# EasyEDA Pro project 9DTact_LED_ProEAD.epro

# Schematic LED-SCHEME
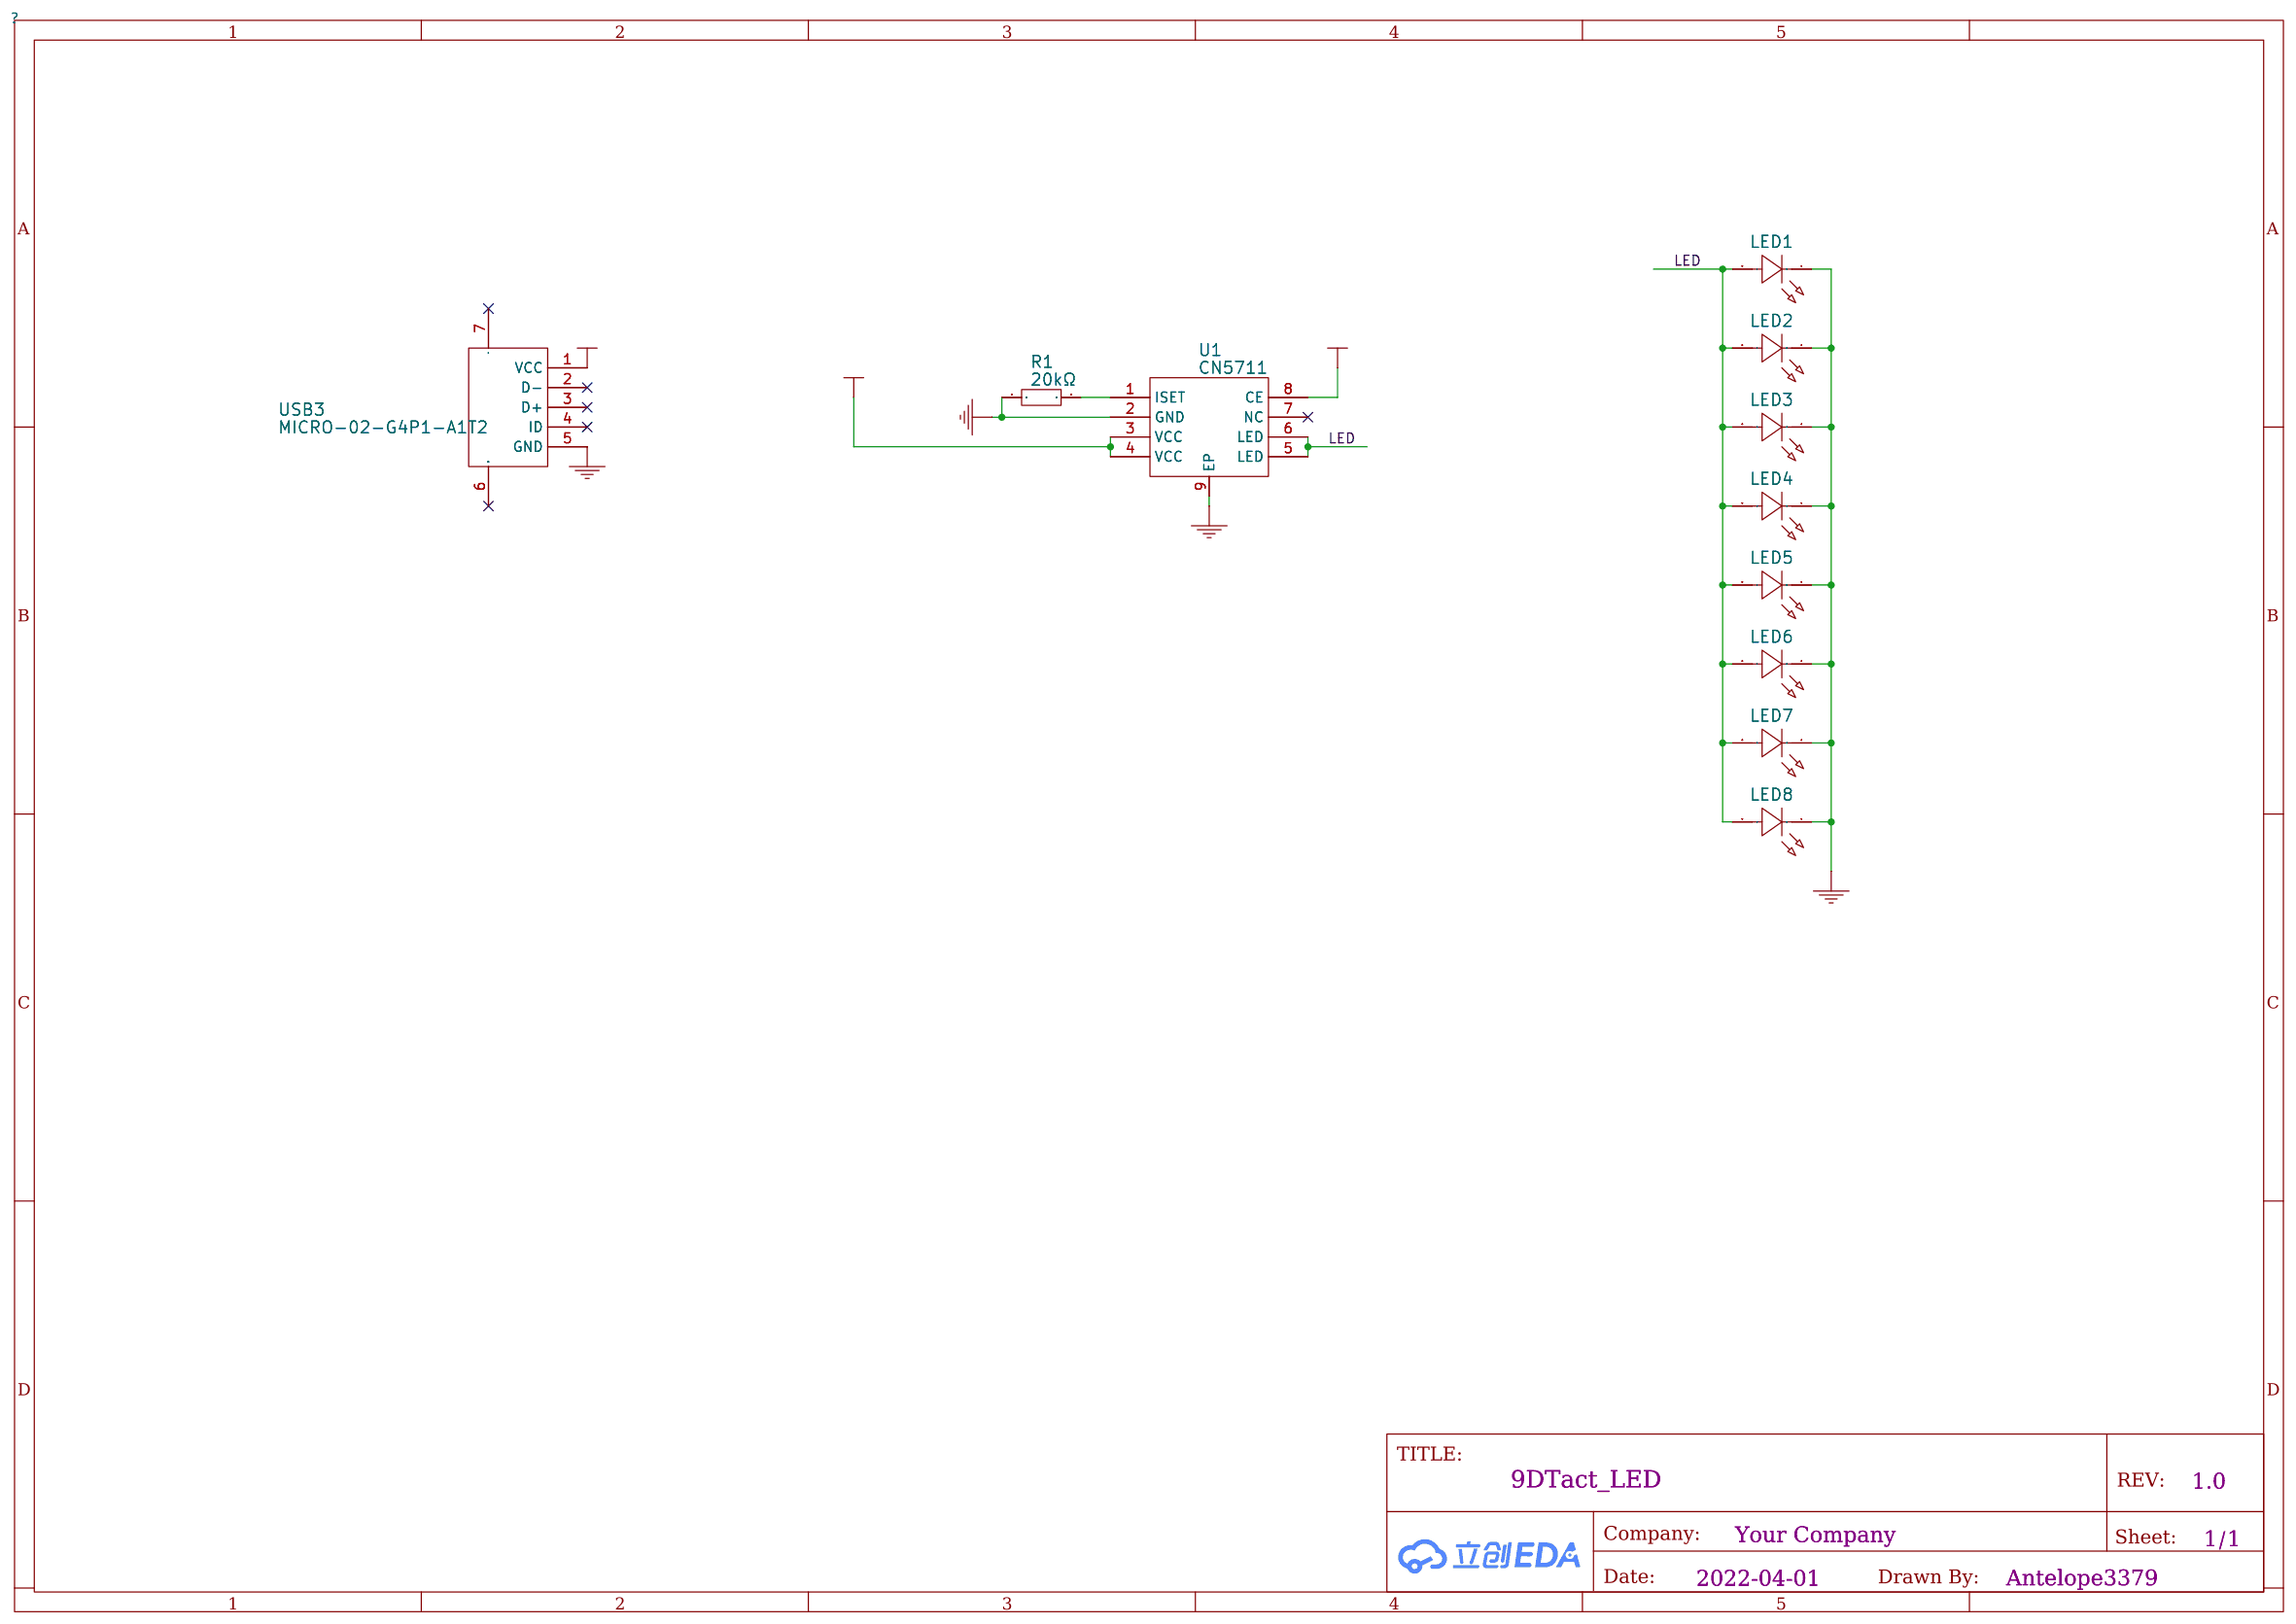
[diagram p0: schematic sheet]

## Parts
LED1  BZ-S2835BW9C1-02-3V-UV  [LED-SMD_L3.5-W2.8-FD-2835_WHITE]
LED2  BZ-S2835BW9C1-02-3V-UV  [LED-SMD_L3.5-W2.8-FD-2835_WHITE]
LED3  BZ-S2835BW9C1-02-3V-UV  [LED-SMD_L3.5-W2.8-FD-2835_WHITE]
LED4  BZ-S2835BW9C1-02-3V-UV  [LED-SMD_L3.5-W2.8-FD-2835_WHITE]
LED5  BZ-S2835BW9C1-02-3V-UV  [LED-SMD_L3.5-W2.8-FD-2835_WHITE]
LED6  BZ-S2835BW9C1-02-3V-UV  [LED-SMD_L3.5-W2.8-FD-2835_WHITE]
LED7  BZ-S2835BW9C1-02-3V-UV  [LED-SMD_L3.5-W2.8-FD-2835_WHITE]
LED8  BZ-S2835BW9C1-02-3V-UV  [LED-SMD_L3.5-W2.8-FD-2835_WHITE]
R1  20kΩ  [R0805]
U1  CN5711  [SOIC-8_L5.0-W4.0-P1.27-LS6.0-BL-EP2.0]
USB3  MICRO-02-G4P1-A1T2  [MICRO-USB-SMD_MICRO-02-GXPX-A1T2]

## Library data of the parts
LED1-LED8 = BZ-S2835BW9C1-02-3V-UV: Supplier: LCSC; Supplier Part: C2833052; Manufacturer: baizou(百洲）; JLCPCB Part Class: Extended Part
R1 = RT0805CRE0720KL: 电阻类型:薄膜电阻;阻值:20kΩ;精度:±0.25%;功率:125mW;温度系数:±50ppm/℃;最大工作电压:150V;工作温度范围:-55℃~+155℃;; LCSC Part Name: 20kΩ ±0.25% 125mW; Supplier Part: C706298; Manufacturer: YAGEO(国巨); Supplier Footprint: 0805; JLCPCB Part Class: Extended Part; Datasheet: https://atta.szlcsc.com/upload/public/pdf/source/20200720/C706298_900BC745E8F0EA9E363C5A9A379AB5A6.pdf; Supplier: LCSC; Type: 薄膜电阻; Tolerance: ±0.25%; Power(Watts): 125mW; Temperature Coefficient: ±50ppm/℃; Overload Voltage (Max): 150V; Operating Temperature Range: -55℃~+155℃; Resistance: 3.75K
U1 = CN5711: Supplier: LCSC; Manufacturer: CONSONANCE(上海如韵); Supplier Part: C35634; JLCPCB Part Class: Extended Part
USB3 = MICRO-02-G4P1-A1T2: Supplier: LCSC; Supplier Part: C2682525; Manufacturer: Yuandi(台湾元迪); JLCPCB Part Class: Extended Part

## Nets
GND: LED1.1(K) LED2.1(K) LED3.1(K) LED4.1(K) LED5.1(K) LED6.1(K) LED7.1(K) LED8.1(K) R1.1 U1.2(GND) U1.9(EP) USB3.5(GND)
VCC: U1.3(VCC) U1.4(VCC) U1.8(CE) USB3.1(VCC)
LED: LED1.2(A) LED2.2(A) LED3.2(A) LED4.2(A) LED5.2(A) LED6.2(A) LED7.2(A) LED8.2(A) U1.5(LED) U1.6(LED)
Net-(R1-2): R1.2 U1.1(ISET)

Not connected (* = marked no-connect by the designer): U1 7(NC)*; USB3 2(D-)* 3(D+)* 4(ID)* 6* 7*

# Board LED-PCB
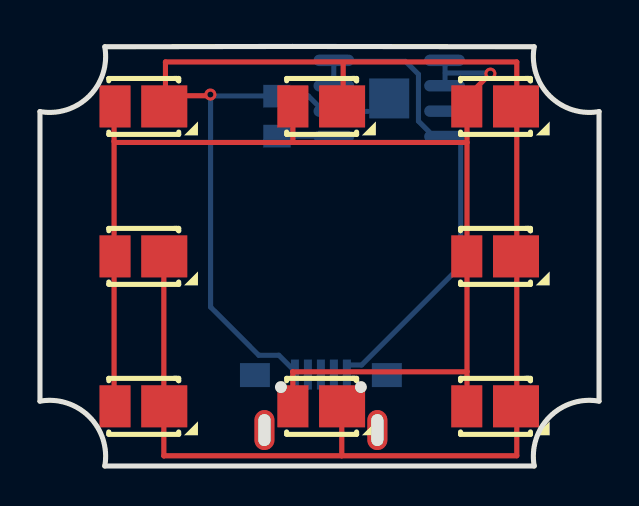
[diagram p1: board, top side]
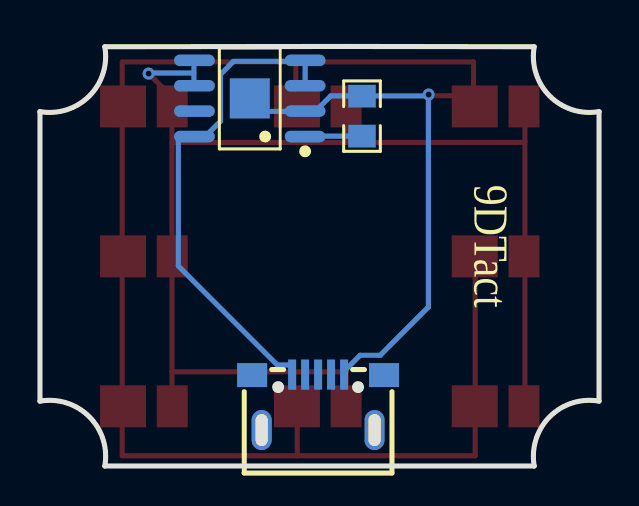
[diagram p2: board, bottom side, seen from below]

Outline 27.97 x 20.99 mm; copper layers: Top Layer, Bottom Layer. Coordinates in mm from the lower left corner of the outline.
Outline path: 0,3.24 0,17.73 arc(2.47,18.51) 3.24,20.97 12.64,20.99 24.73,20.97 arc(25.51,18.51) 27.97,17.73 27.97,3.24 arc(25.51,2.47) 24.73,0 3.24,0 arc(2.47,2.47) 0,3.24
Stack: Top Layer 0.035mm / Dielectric1 1.51mm FR4 er 4.5 / Bottom Layer 0.035mm

## Design rules (mm)
spacing Default (default): track to track 0.152, other pairs 0 to 0.152
track width Default (default): min 0.254, default 0.254, max 25.4
differential pair differentialPair (default): width min 0.127, default 0.254, max 2.54; gap min 0.152, default 0.152
via Default (default): diameter min 0.6, default 0.6, max 100.025; hole min 0.305, default 0.305, max 59.995

## Placement (name value [footprint] x y rotation side)
LED1  BZ-S2835BW9C1-02-3V-UV  [LED-SMD_L3.5-W2.8-FD-2835_WHITE]  4.99 17.99 0 top
LED2  BZ-S2835BW9C1-02-3V-UV  [LED-SMD_L3.5-W2.8-FD-2835_WHITE]  13.89 17.99 0 top
LED3  BZ-S2835BW9C1-02-3V-UV  [LED-SMD_L3.5-W2.8-FD-2835_WHITE]  22.59 17.99 0 top
LED4  BZ-S2835BW9C1-02-3V-UV  [LED-SMD_L3.5-W2.8-FD-2835_WHITE]  4.99 10.49 0 top
LED5  BZ-S2835BW9C1-02-3V-UV  [LED-SMD_L3.5-W2.8-FD-2835_WHITE]  22.59 10.49 0 top
LED6  BZ-S2835BW9C1-02-3V-UV  [LED-SMD_L3.5-W2.8-FD-2835_WHITE]  4.99 2.99 0 top
LED7  BZ-S2835BW9C1-02-3V-UV  [LED-SMD_L3.5-W2.8-FD-2835_WHITE]  13.89 2.99 0 top
LED8  BZ-S2835BW9C1-02-3V-UV  [LED-SMD_L3.5-W2.8-FD-2835_WHITE]  22.59 2.99 0 top
R1  -  [R0805]  11.86 17.5 270 bottom
U1  CN5711  [SOIC-8_L5.0-W4.0-P1.27-LS6.0-BL-EP2.0]  17.47 18.39 90 bottom
USB3  MICRO-02-G4P1-A1T2  [MICRO-USB-SMD_MICRO-02-GXPX-A1T2]  14.06 3.19 180 bottom

## Footprints (pads in the part's own frame, mm; a bottom-side part is the same pattern mirrored in y, then rotated)
LED-SMD_L3.5-W2.8-FD-2835_WHITE
  rect 2.3x2.1 smd: 1(1.231,0)
  rect 1.55x2.1 smd: 2(-1.232,0)
MICRO-USB-SMD_MICRO-02-GXPX-A1T2
  rect 0.4x1.5 smd: 1(-1.3,1.387) 2(-0.65,1.387) 3(0,1.387) 4(0.65,1.387) 5(1.3,1.387)
  rect 1.5x1.2 smd: 6(-3.3,1.363) 7(3.3,1.363)
  oval 1x2 hole 0.61x1.6: 8(-2.825,-1.387) 9(2.825,-1.387)
R0805
  rect 1.133x1.377 smd: 1(-1,0) 2(1,0)
SOIC-8_L5.0-W4.0-P1.27-LS6.0-BL-EP2.0
  oval 0.574x2.038 smd: 1(-1.905,-2.769) 2(-0.635,-2.769) 3(0.635,-2.769) 4(1.905,-2.769) 5(1.905,2.769) 6(0.635,2.769) 7(-0.635,2.769) 8(-1.905,2.769)
  rect 2x2 smd: 9(0,0)

## Nets
GND: LED1.1 LED2.1 LED3.1 LED4.1 LED5.1 LED6.1 LED7.1 LED8.1 R1.1 U1.2 U1.9 USB3.5
VCC: U1.3 U1.4 U1.8 USB3.1
LED1_2: LED1.2 LED2.2 LED3.2 LED4.2 LED5.2 LED6.2 LED7.2 LED8.2 U1.5 U1.6
U1_1: R1.2 U1.1

Pads without a net: U1 7; USB3 2 3 4 6 7 8 9

## Via types
v1: diameter 0.6, hole 0.305, Top Layer to Bottom Layer, 2 vias

## Routing (per net, layer and track width the routed paths; a pad name or vN(x,y) marks a point on that pad's centre or on a via; arc(x,y) is an arc through that point)
GND: length 98.4
  Top Layer w0.254: 15.09,0.51 6.2,0.51 6.2,0.51 6.2,10.35 6.35,10.5 ; 15.09,0.51 15.1,0.52 15.1,3 ; 15.09,0.51 23.86,0.51 23.86,20.21 6.28,20.21 6.28,18.52 ; 6.28,18.52 6.26,18.52 ; 6.28,18.52 8.47,18.52 v1(8.53,18.58) ; 6.28,18.52 6.28,18.11 6.38,18 ; 15.17,17.95 15.17,20.13
  Bottom Layer w0.254: 11.86,18.51 8.6,18.51 v1(8.53,18.58) ; 16.4,17.74 14.2,17.74 13.43,18.51 11.87,18.51 ; 8.47,18.41 8.54,18.34 8.54,7.95 10.95,5.54 11.95,5.54 12.72,4.78 12.72,4.77
VCC: length 23.8
  Bottom Layer w0.254: 21.05,16.46 21.05,10.01 16.09,5.05 15.38,5.05 ; 20.25,16.48 19.7,16.48 18.94,17.25 18.94,19.59 18.29,20.24 14.85,20.24 14.81,20.28 ; 14.7,19.03 14.7,20.16 14.76,20.22
LED1_2: length 65.5
  Top Layer w0.254: 21.37,17.95 21.37,16.18 ; 21.37,16.18 21.37,4.72 ; 21.37,16.18 12.66,16.18 ; 21.37,18.03 21.37,18.46 v1(22.54,19.63) ; 3.71,16.23 3.71,3.08 3.76,3.02 ; 3.71,16.23 3.76,16.18 12.66,16.18 ; 3.71,16.23 3.71,18 ; 12.65,17.95 12.65,16.19 12.66,16.18 ; 21.37,4.72 21.36,4.71 12.64,4.71 12.65,4.71 12.65,2.98 ; 21.37,4.72 21.37,3.02
  Bottom Layer w0.254: 20.27,20.32 20.27,19.04 20.29,19.02 ; 20.28,19.66 22.51,19.66 v1(22.54,19.63)
U1_1: length 3.5
  Bottom Layer w0.254: 14.59,16.5 15.35,16.5 ; 14.59,16.5 11.92,16.5 ; 14.59,16.5 14.66,16.43

## Text on the board
Bottom Silkscreen Layer: 9DTact
